# Altium schematic sheet CT310高端控制盒B区按键电路V1.0.SchDoc
size A4
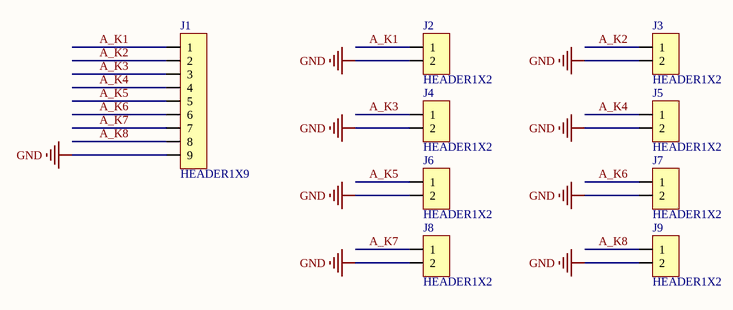
[diagram p0: CT310高端控制盒B区按键电路V1.0.SchDoc]

## Parts
J1  HEADER1X9  [ZH1X9LT-1.5]
J2  HEADER1X2  [괌칟객숩]
J3  HEADER1X2  [괌칟객숩]
J4  HEADER1X2  [괌칟객숩]
J5  HEADER1X2  [괌칟객숩]
J6  HEADER1X2  [괌칟객숩]
J7  HEADER1X2  [괌칟객숩]
J8  HEADER1X2  [괌칟객숩]
J9  HEADER1X2  [괌칟객숩]

## Nets
GND: J1.9 J2.2 J3.2 J4.2 J5.2 J6.2 J7.2 J8.2 J9.2
A_K1: J1.1 J2.1
A_K2: J1.2 J3.1
A_K3: J1.3 J4.1
A_K4: J1.4 J5.1
A_K5: J1.5 J6.1
A_K6: J1.6 J7.1
A_K7: J1.7 J8.1
A_K8: J1.8 J9.1